# Altium schematic sheet EPROM-EMU.SchDoc
size A2; SheetNumber: 1; SheetTotal: 1
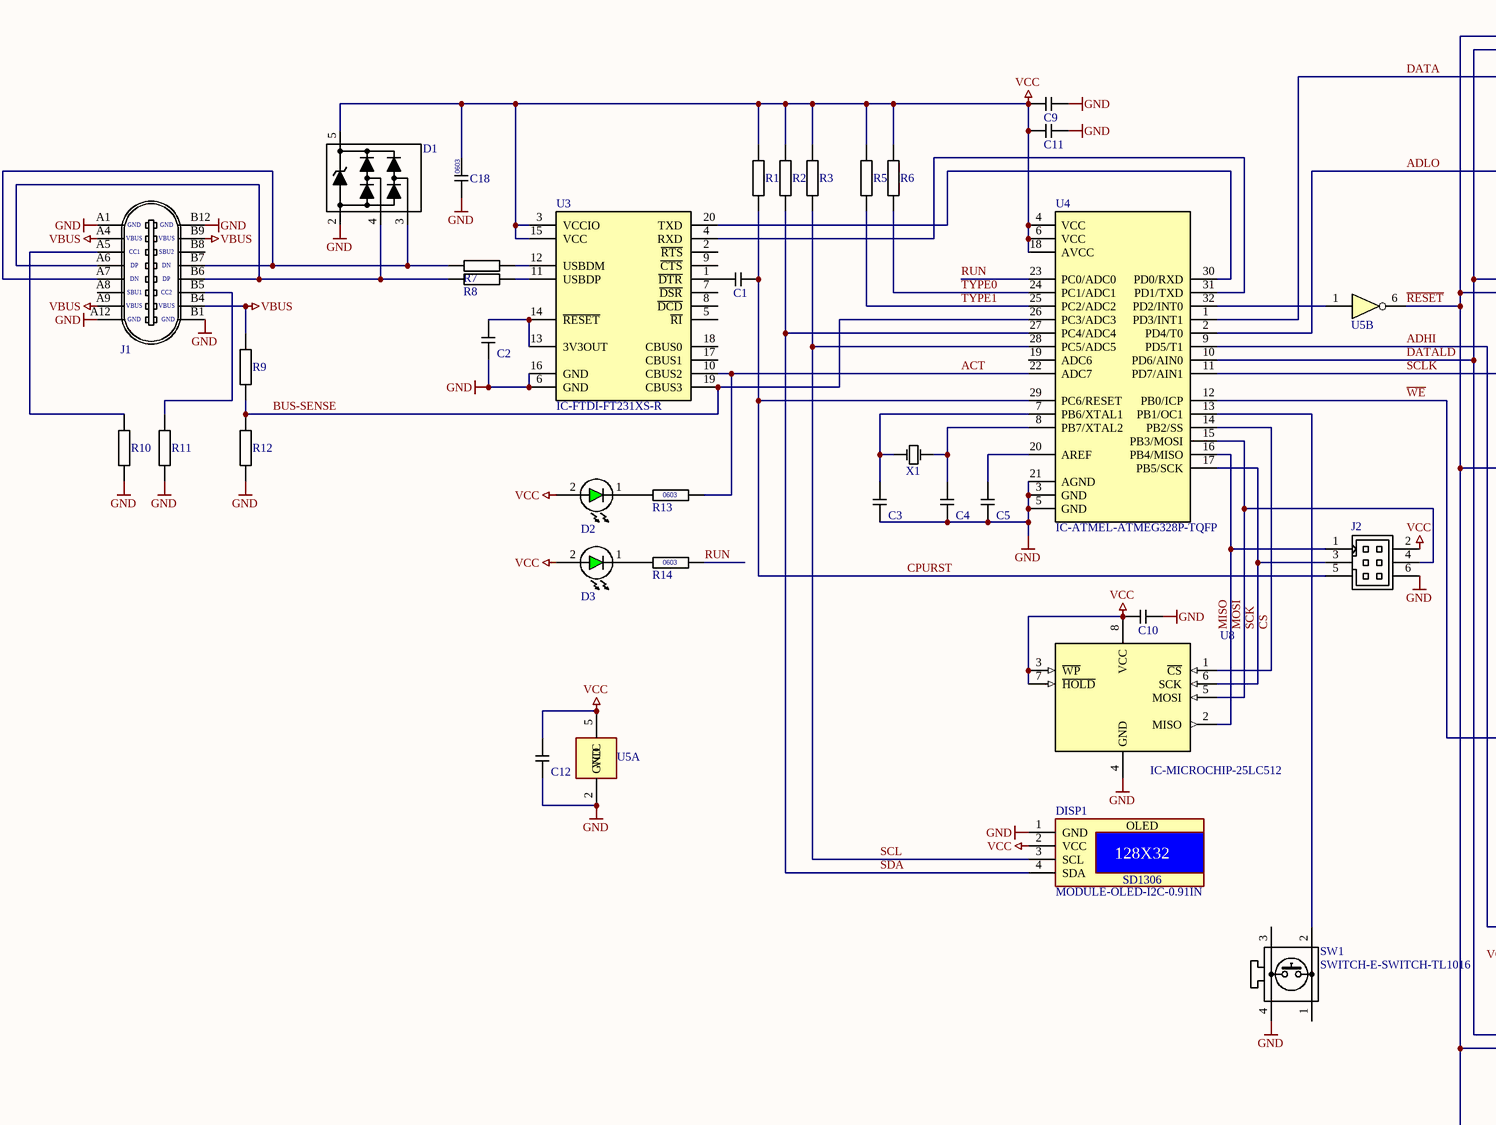
[diagram p0: EPROM-EMU.SchDoc, left]
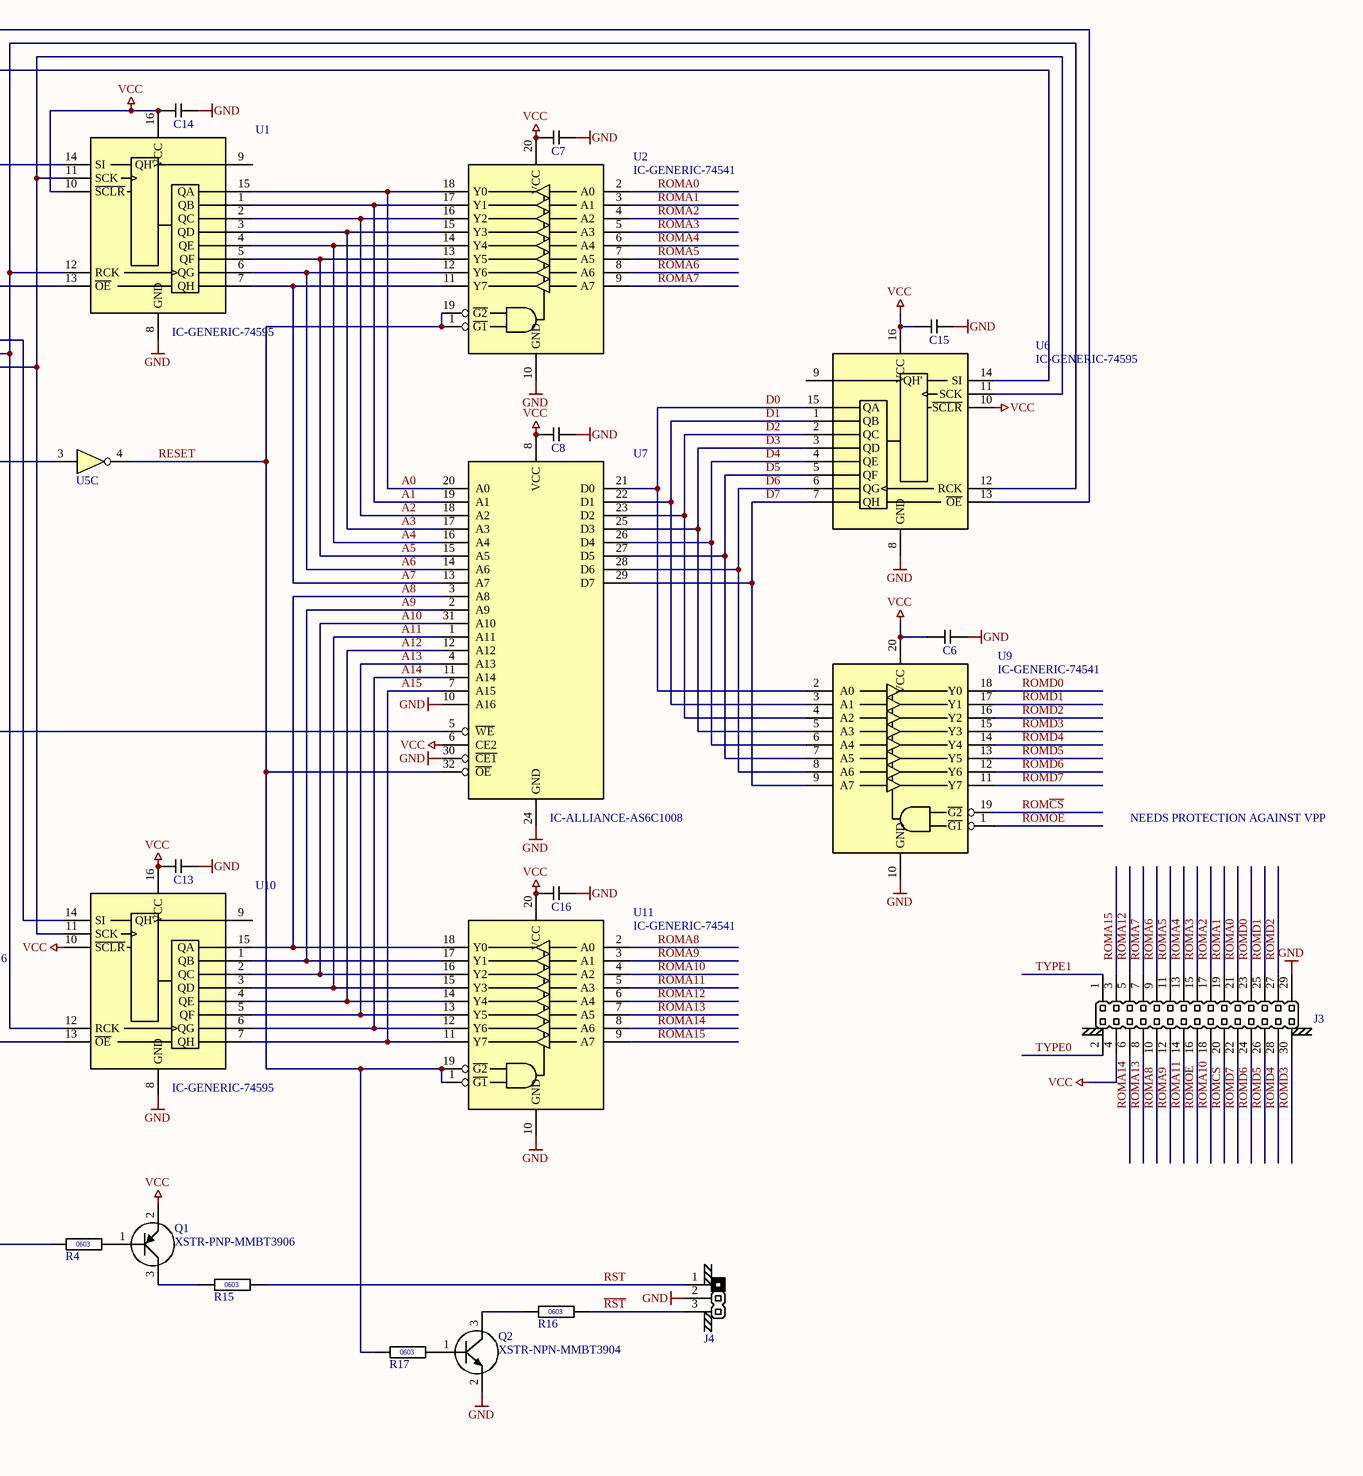
[diagram p1: EPROM-EMU.SchDoc, right]

## Parts
C1  GENERIC-CAP  [CAP0603]  (value not drawn)
C2  GENERIC-CAP  [CAP0603]  (value not drawn)
C3  GENERIC-CAP  [CAP0603]  (value not drawn)
C4  GENERIC-CAP  [CAP0603]  (value not drawn)
C5  GENERIC-CAP  [CAP0603]  (value not drawn)
C6  GENERIC-CAP  [CAP0603]  (value not drawn)
C7  GENERIC-CAP  [CAP0603]  (value not drawn)
C8  GENERIC-CAP  [CAP0603]  (value not drawn)
C9  GENERIC-CAP  [CAP0603]  (value not drawn)
C10  GENERIC-CAP  [CAP0603]  (value not drawn)
C11  GENERIC-CAP  [CAP0603]  (value not drawn)
C12  GENERIC-CAP  [CAP0603]  (value not drawn)
C13  GENERIC-CAP  [CAP0603]  (value not drawn)
C14  GENERIC-CAP  [CAP0603]  (value not drawn)
C15  GENERIC-CAP  [CAP0603]  (value not drawn)
C16  GENERIC-CAP  [CAP0603]  (value not drawn)
C18  GENERIC-CAP-0603  [CAP0603]  (value not drawn)
D1  TVS-WURTH-824011  [SOT23-5]  (value not drawn)
D2  LED-PLCC2-GREEN  [LED-PLCC2-GREEN]  (value not drawn)
D3  LED-PLCC2-GREEN  [LED-PLCC2-GREEN]  (value not drawn)
DISP1  MODULE-OLED-I2C-0.91IN  [DISP-OLED-128X32]
J1  CUNN-USBC-USB2-VERT  [CONN-GCT-USB4085]  (value not drawn)
J2  BOXHEADER-3X2  [HEADER-2X3-1.27]  (value not drawn)
J3  CONN-HEADER-RA-PIN-15X2  [HEADER-2X15-RA]  (value not drawn)
J4  CONN-HEADER-PIN-1X3-254-RA  [HEADER-1X3-245-RA]  (value not drawn)
Q1  XSTR-PNP-MMBT3906  [SOT23]
Q2  XSTR-NPN-MMBT3904  [SOT23]
R1  GENERIC-RES  [RES0603]  (value not drawn)
R2  GENERIC-RES  [RES0603]  (value not drawn)
R3  GENERIC-RES  [RES0603]  (value not drawn)
R4  GENERIC-RES-0603  [RES0603]  (value not drawn)
R5  GENERIC-RES  [RES0603]  (value not drawn)
R6  GENERIC-RES  [RES0603]  (value not drawn)
R7  GENERIC-RES  [RES0603]  (value not drawn)
R8  GENERIC-RES  [RES0603]  (value not drawn)
R9  GENERIC-RES  [RES0603]  (value not drawn)
R10  GENERIC-RES  [RES0603]  (value not drawn)
R11  GENERIC-RES  [RES0603]  (value not drawn)
R12  GENERIC-RES  [RES0603]  (value not drawn)
R13  GENERIC-RES-0603  [RES0603]  (value not drawn)
R14  GENERIC-RES-0603  [RES0603]  (value not drawn)
R15  GENERIC-RES-0603  [RES0603]  (value not drawn)
R16  GENERIC-RES-0603  [RES0603]  (value not drawn)
R17  GENERIC-RES-0603  [RES0603]  (value not drawn)
SW1  SWITCH-E-SWITCH-TL1016  [SWITCH-ESWITCH-TL1016]
U1  IC-GENERIC-74595  [SO65P640X120-16N]
U2  IC-GENERIC-74541  [SO65P640X110-20N]
U3  IC-FTDI-FT231XS-R  [TSOP65P640-20N]
U4  IC-ATMEL-ATMEG328P-TQFP  [QFP80P900X900-32N]
U5  IC-TI-SN74LVC2G14  [SOT23-6]  (value not drawn)  (parts A,B,C of 3)
U6  IC-GENERIC-74595  [SO65P640X120-16N]
U7  IC-ALLIANCE-AS6C1008  [TSSOP50P1340X125-32N]
U8  IC-MICROCHIP-25LC512  [SO127P600-8N]
U9  IC-GENERIC-74541  [SO65P640X110-20N]
U10  IC-GENERIC-74595  [SO65P640X120-16N]
U11  IC-GENERIC-74541  [SO65P640X110-20N]
X1  CRYSTAL-2PIN  [XTAL-ABRACON-ABM3]  (value not drawn)

## Nets
GND: C2.2 C3.2 C4.2 C5.2 C6.2 C7.2 C8.2 C9.2 C10.2 C11.2 C12.2 C13.2 C14.2 C15.2 C16.2 C18.2 D1.2(A) DISP1.1(GND) J1.A1 J1.A12 J1.B1 J1.B12 J2.6(-) J3.29(-) J4.2(+) Q2.2(E) R10.2 R11.2 R12.2 SW1.4 U1.8(GND) U2.10(GND) U3.6(GND) U3.16(GND) U4.3(GND) U4.5(GND) U4.21(AGND) U5.2(GND) U6.8(GND) U7.10(A16) U7.24(GND) U7.30(~{CE1}) U8.4(GND) U9.10(GND) U10.8(GND) U11.10(GND)
VBUS: J1.A4 J1.A9 J1.B4 J1.B9 R9.1
VCC: C6.1 C7.1 C8.1 C9.1 C10.1 C11.1 C12.1 C13.1 C14.1 C15.1 C16.1 C18.1 D1.5(A) D2.2(K) D3.2(K) DISP1.2(VCC) J2.2(-) J3.4(-) Q1.2(E) R1.2 R2.2 R3.2 R5.2 R6.2 U1.10(~{SCLR}) U1.16(VCC) U2.20(VCC) U3.3(VCCIO) U3.15(VCC) U4.4(VCC) U4.6(VCC) U4.18(AVCC) U5.5(VCC) U6.10(~{SCLR}) U6.16(VCC) U7.6(CE2) U7.8(VCC) U8.3(~{WP}) U8.7(~{HOLD}) U8.8(VCC) U9.20(VCC) U10.10(~{SCLR}) U10.16(VCC) U11.20(VCC)
A0: U1.15(QA) U2.18(Y0) U7.20(A0)
A1: U1.1(QB) U2.17(Y1) U7.19(A1)
A2: U1.2(QC) U2.16(Y2) U7.18(A2)
A3: U1.3(QD) U2.15(Y3) U7.17(A3)
A4: U1.4(QE) U2.14(Y4) U7.16(A4)
A5: U1.5(QF) U2.13(Y5) U7.15(A5)
A6: U1.6(QG) U2.12(Y6) U7.14(A6)
A7: U1.7(QH) U2.11(Y7) U7.13(A7)
A8: U7.3(A8) U10.15(QA) U11.18(Y0)
A9: U7.2(A9) U10.1(QB) U11.17(Y1)
A10: U7.31(A10) U10.2(QC) U11.16(Y2)
A11: U7.1(A11) U10.3(QD) U11.15(Y3)
A12: U7.12(A12) U10.4(QE) U11.14(Y4)
A13: U7.4(A13) U10.5(QF) U11.13(Y5)
A14: U7.11(A14) U10.6(QG) U11.12(Y6)
A15: U7.7(A15) U10.7(QH) U11.11(Y7)
ACT: R13.1 U3.10(CBUS2) U4.22(ADC7)
ADHI: U4.9(PD5/T1) U10.14(SI)
ADLO: U1.14(SI) U4.2(PD4/T0)
BUS-SENSE: R9.2 R12.1 U3.19(CBUS3) U4.26(PC3/ADC3)
~{CS}: U4.14(PB2/SS) U8.1(~{CS})
CPURST: C1.2 J2.5(-) R1.1 U4.29(PC6/RESET)
D0: U6.15(QA) U7.21(D0) U9.2(A0)
D1: U6.1(QB) U7.22(D1) U9.3(A1)
D2: U6.2(QC) U7.23(D2) U9.4(A2)
D3: U6.3(QD) U7.25(D3) U9.5(A3)
D4: U6.4(QE) U7.26(D4) U9.6(A4)
D5: U6.5(QF) U7.27(D5) U9.7(A5)
D6: U6.6(QG) U7.28(D6) U9.8(A6)
D7: U6.7(QH) U7.29(D7) U9.9(A7)
DATA: U4.1(PD3/INT1) U6.14(SI)
DATALD: U1.12(RCK) U4.10(PD6/AIN0) U6.12(RCK) U10.12(RCK)
MISO: J2.1(+) U4.16(PB4/MISO) U8.2(MISO)
MOSI: J2.4(-) U4.15(PB3/MOSI) U8.5(MOSI)
~{RESET}: R4.2 U1.13(~{OE}) U5.3 U5.6 U6.13(~{OE}) U10.13(~{OE})
~{RST}: J4.3(+) R16.1
RESET: R17.2 U2.1(~{G1}) U2.19(~{G2}) U5.4 U7.32(~{OE}) U11.1(~{G1}) U11.19(~{G2})
ROMA0: J3.21(-) U2.2(A0)
ROMA1: J3.19(+) U2.3(A1)
ROMA2: J3.17(-) U2.4(A2)
ROMA3: J3.15(-) U2.5(A3)
ROMA4: J3.13(+) U2.6(A4)
ROMA5: J3.11(-) U2.7(A5)
ROMA6: J3.9(-) U2.8(A6)
ROMA7: J3.7(+) U2.9(A7)
ROMA8: J3.10(-) U11.2(A0)
ROMA9: J3.12(-) U11.3(A1)
ROMA10: J3.18(-) U11.4(A2)
ROMA11: J3.14(-) U11.5(A3)
ROMA12: J3.5(-) U11.6(A4)
ROMA13: J3.8(-) U11.7(A5)
ROMA14: J3.6(-) U11.8(A6)
ROMA15: J3.3(-) U11.9(A7)
ROM~{CS}: J3.20(-) U9.19(~{G2})
ROMD0: J3.23(-) U9.18(Y0)
ROMD1: J3.25(+) U9.17(Y1)
ROMD2: J3.27(-) U9.16(Y2)
ROMD3: J3.30(-) U9.15(Y3)
ROMD4: J3.28(-) U9.14(Y4)
ROMD5: J3.26(-) U9.13(Y5)
ROMD6: J3.24(-) U9.12(Y6)
ROMD7: J3.22(-) U9.11(Y7)
ROM~{OE}: J3.16(-) U9.1(~{G1})
RST: J4.1(+) R15.1
RUN: R14.1 U4.23(PC0/ADC0)
SCK: J2.3(-) U4.17(PB5/SCK) U8.6(SCK)
SCL: DISP1.3(SCL) R3.1 U4.28(PC5/ADC5)
SCLK: U1.11(SCK) U4.11(PD7/AIN1) U6.11(SCK) U10.11(SCK)
SDA: DISP1.4(SDA) R2.1 U4.27(PC4/ADC4)
TYPE0: J3.2(-) R6.1 U4.24(PC1/ADC1)
TYPE1: J3.1(+) R5.1 U4.25(PC2/ADC2)
~{WE}: U4.12(PB0/ICP) U7.5(~{WE})
NetC1_1: C1.1 U3.1(~{DTR})
NetC2_1: C2.1 U3.13(3V3OUT) U3.14(~{RESET})
NetC3_1: C3.1 U4.7(PB6/XTAL1) X1.1(OSC1)
NetC4_1: C4.1 U4.8(PB7/XTAL2) X1.2(OSC2)
NetC5_1: C5.1 U4.20(AREF)
NetD1_3: D1.3(A) J1.A7 J1.B7 R7.1
NetD1_4: D1.4(A) J1.A6 J1.B6 R8.1
NetD2_1: D2.1(A) R13.2
NetD3_1: D3.1(A) R14.2
NetJ1_A5: J1.A5 R10.1
NetJ1_B5: J1.B5 R11.1
NetQ1_1: Q1.1(B) R4.1
NetQ1_3: Q1.3(C) R15.2
NetQ2_1: Q2.1(B) R17.1
NetQ2_3: Q2.3(C) R16.2
NetR7_2: R7.2 U3.12(USBDM)
NetR8_2: R8.2 U3.11(USBDP)
NetSW1_2: SW1.2 U4.13(PB1/OC1)
NetU3_4: U3.4(RXD) U4.31(PD1/TXD)
NetU3_20: U3.20(TXD) U4.30(PD0/RXD)
NetU4_32: U4.32(PD2/INT0) U5.1

Not connected (* = marked no-connect by the designer): J1 A8 B8; SW1 1 3; U1 9(QH'); U3 2(~{RTS}) 5(~{RI}) 7(~{DSR}) 8(~{DCD}) 9(~{CTS}) 17(CBUS1) 18(CBUS0); U4 19(ADC6); U6 9(QH'); U10 9(QH')

## Notes on the sheet
- NEEDS PROTECTION AGAINST VPP
- (in symbol CUNN-USBC-USB2-VERT) GND; VBUS; CC1; SBU2; DP; DN; SBU1; CC2
- (in symbol GENERIC-CAP-0603) 0603
- (in symbol GENERIC-RES-0603) 0603
- (in symbol MODULE-OLED-I2C-0.91IN) OLED; 128X32; SD1306

## Library data of the parts
J2 = CONN-BOXHEADER-3X2
U5 = IC-TI-SN74LVC2G14: IC-GENERIC-7408IC-TI-SN74LVC2G14
X1 = CRYSTAL-2PIN: CRYSTAL 2 PIN GENERIC
D1 = TVS-WURTH-824011: Supplier 1: Digikey; Supplier Part Number 1: 732-4465-1-ND